# Altium schematic sheet CE842170260_SHEET6.SchDoc
size Tabloid; SheetNumber: 4; SheetTotal: 4; PageSetup: Record=PageOptions|CenterHorizontal=True|CenterVertical=True|PrintScale=0.70|XCorrection=1.00|YCorrection=1.00|PrintKind=1|BorderSize=5000000|LeftOffset=0|BottomOffset=0|Orientation=2|PaperLength=1000|PaperWidth=1000|Scale=100|PaperSource=7|PrintQuality=-4|MediaType=1|DitherType=10|PaperKind=8 1/2x11|PrintScaleMode=1; SPICEModelCacheMIYJXAQF: <root> / <DocumentId>MIYJXAQF</DocumentId> / </root>
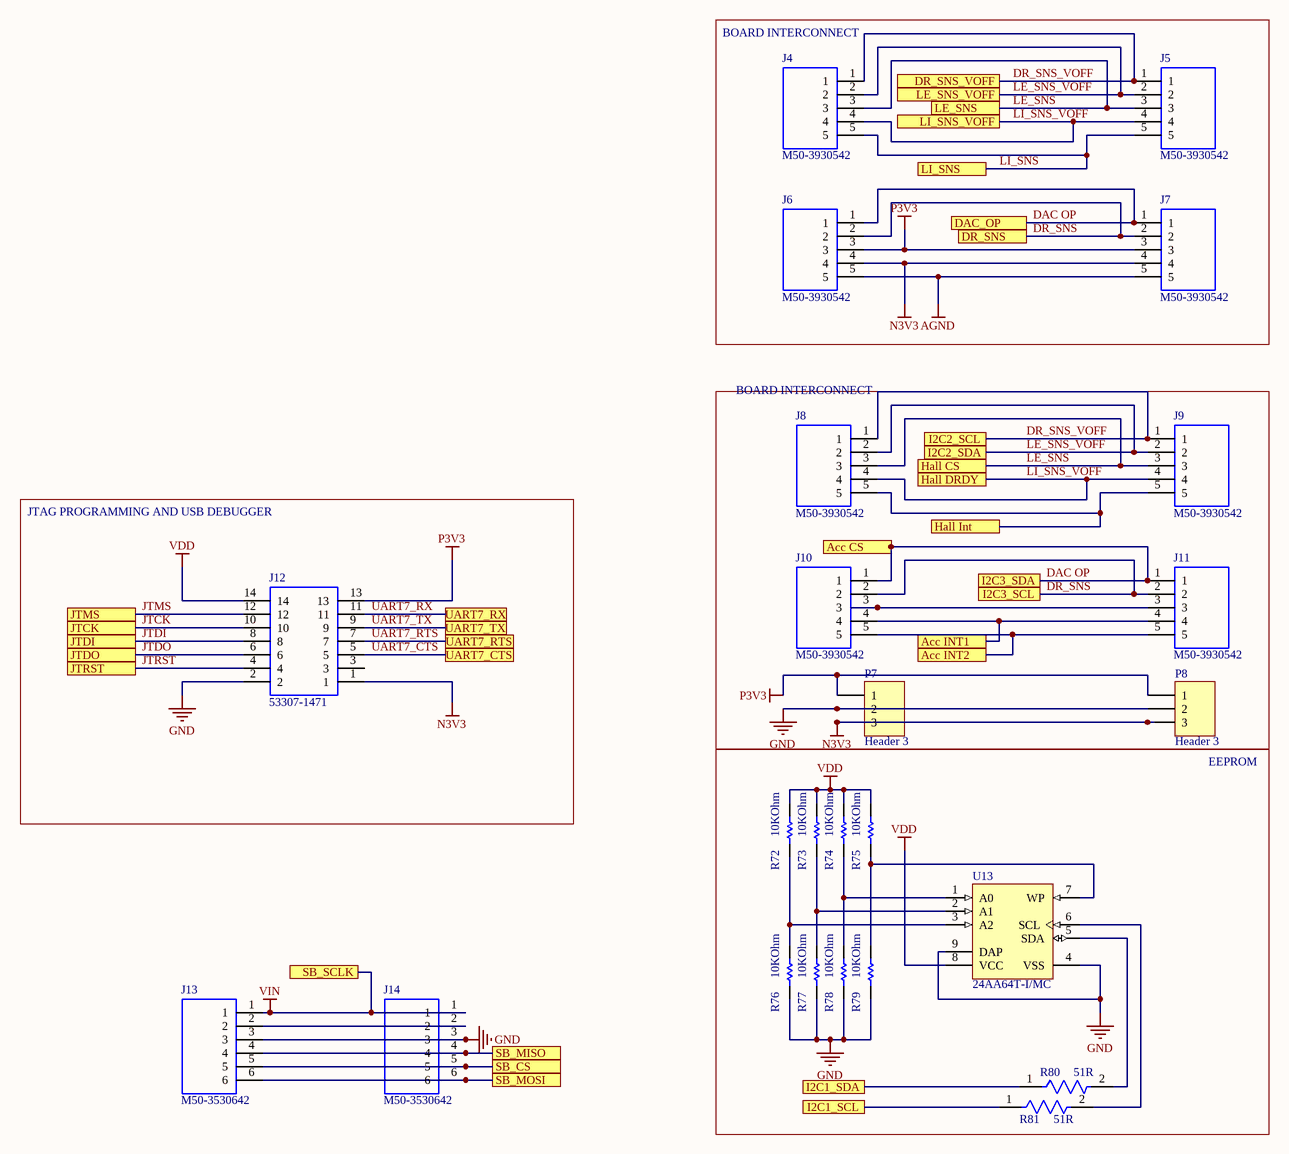
[diagram p0: CE842170260_SHEET6.SchDoc]

## Parts
J4  M50-3930542  [M50-3930542]
J5  M50-3930542  [M50-3930542]
J6  M50-3930542  [M50-3930542]
J7  M50-3930542  [M50-3930542]
J8  M50-3930542  [M50-3930542]
J9  M50-3930542  [M50-3930542]
J10  M50-3930542  [M50-3930542]
J11  M50-3930542  [M50-3930542]
J12  53307-1471  [533071471]
J13  M50-3530642  [HDRV6W30P0X127_1X6_762X210X430P]
J14  M50-3530642  [HDRV6W30P0X127_1X6_762X210X430P]
P7  Header 3  [HDR1X3]
P8  Header 3  [HDR1X3]
R72  Resistance: 10KOhm  [RESC1005X40X25LL05T05]  (hidden comment: ERJ2RKF1002X)
R73  Resistance: 10KOhm  [RESC1005X40X25LL05T05]  (hidden comment: ERJ2RKF1002X)
R74  Resistance: 10KOhm  [RESC1005X40X25LL05T05]  (hidden comment: ERJ2RKF1002X)
R75  Resistance: 10KOhm  [RESC1005X40X25LL05T05]  (hidden comment: ERJ2RKF1002X)
R76  Resistance: 10KOhm  [RESC1005X40X25LL05T05]  (hidden comment: ERJ2RKF1002X)
R77  Resistance: 10KOhm  [RESC1005X40X25LL05T05]  (hidden comment: ERJ2RKF1002X)
R78  Resistance: 10KOhm  [RESC1005X40X25LL05T05]  (hidden comment: ERJ2RKF1002X)
R79  Resistance: 10KOhm  [RESC1005X40X25LL05T05]  (hidden comment: ERJ2RKF1002X)
R80  Resistance: 51R  [FP-ERJ2RK-MFG]  (hidden comment: ERJ-2RKF51R0X)
R81  Resistance: 51R  [FP-ERJ2RK-MFG]  (hidden comment: ERJ-2RKF51R0X)
U13  24AA64T-I/MC  [DFN-MC8]

## Blocks framed on the sheet
BOARD INTERCONNECT: J4-J7
BOARD INTERCONNECT: J8-J11 P7 P8
JTAG PROGRAMMING AND USB DEBUGGER: J12
EEPROM: R72-R81 U13

## Ports
Acc CS, Acc INT1, Acc INT2, DAC_OP, DR_SNS, DR_SNS_VOFF, Hall CS, Hall DRDY, Hall Int, I2C1_SCL, I2C1_SDA, I2C2_SCL, I2C2_SDA, I2C3_SCL, I2C3_SDA, JTCK, JTDI, JTDO, JTMS, JTRST, LE_SNS, LE_SNS_VOFF, LI_SNS, LI_SNS_VOFF, SB_CS, SB_MISO, SB_MOSI, SB_SCLK, UART7_CTS, UART7_RTS, UART7_RX, UART7_TX

## Nets
AGND: J6.5 J7.5
GND: J12.2 J13.3 J14.3 P7.2 P8.2 R76.1 R77.1 R78.1 R79.1 U13.4(VSS) U13.9(DAP)
N3V3: J6.4 J7.4 J12.1 P7.3 P8.3
P3V3: J6.3 J7.3 J12.13 P7.1 P8.1
VDD: J12.14 R72.2 R73.2 R74.2 R75.2 U13.8(VCC)
VIN: J13.1 J14.1 ; port SB_SCLK
Acc INT1: J10.4 J11.4 ; port Acc INT1
Acc INT2: J10.5 J11.5 ; port Acc INT2
DAC OP: J6.1 J7.1 J10.1 J11.1 ; port DAC_OP, port Acc CS, port I2C3_SDA
DR_SNS: J6.2 J7.2 J10.2 J11.2 ; port DR_SNS, port I2C3_SCL
DR_SNS_VOFF: J4.1 J5.1 J8.1 J9.1 ; port DR_SNS_VOFF, port I2C2_SCL
Hall Int: J8.5 J9.5 ; port Hall Int
I2C1_SCL: R81.1 ; port I2C1_SCL
I2C1_SDA: R80.1 ; port I2C1_SDA
JTCK: J12.10 ; port JTCK
JTDI: J12.8 ; port JTDI
JTDO: J12.6 ; port JTDO
JTMS: J12.12 ; port JTMS
JTRST: J12.4 ; port JTRST
LE_SNS: J4.3 J5.3 J8.3 J9.3 ; port LE_SNS, port Hall CS
LE_SNS_VOFF: J4.2 J5.2 J8.2 J9.2 ; port LE_SNS_VOFF, port I2C2_SDA
LI_SNS: J4.5 J5.5 ; port LI_SNS
LI_SNS_VOFF: J4.4 J5.4 J8.4 J9.4 ; port LI_SNS_VOFF, port Hall DRDY
SB_CS: J13.5 J14.5 ; port SB_CS
SB_MISO: J13.4 J14.4 ; port SB_MISO
SB_MOSI: J13.6 J14.6 ; port SB_MOSI
UART7_CTS: J12.5 ; port UART7_CTS
UART7_RTS: J12.7 ; port UART7_RTS
UART7_RX: J12.11 ; port UART7_RX
UART7_TX: J12.9 ; port UART7_TX
NetJ10_3: J10.3 J11.3
NetJ13_2: J13.2 J14.2
NetR72_1: R72.1 R76.2 U13.3(A2)
NetR73_1: R73.1 R77.2 U13.2(A1)
NetR74_1: R74.1 R78.2 U13.1(A0)
NetR75_1: R75.1 R79.2 U13.7(WP)
NetR80_2: R80.2 U13.5(SDA)
NetR81_2: R81.2 U13.6(SCL)

Not connected (* = marked no-connect by the designer): J12 3

## Notes on the sheet
- BH CONFIDENTIAL
- NOTE
- Title:
- Sheet Title:
- Designed:
- Checked:
- Date:
- DRAWN IN ACCORDANCE WITH TECHNOLOGY WORK INSTRUCTIONS W064
- REV
- DATE
- ECR/ECN
- INT'L
- Number:
- Approved:
- FOR LIMITED NEED TO KNOW USE ONLY. NO PARTS OF THIS DOCUMENT MAY BE PRODUCED OR DISCLOSED WITHOUT PRIOR PERMISSION OF BH
- File:
- Sheet:
- of

## Library data of the parts
J4-J11 = M50-3930542: 1.27mm (0.05") Pitch SIL Horizontal Throughboard Pin Header, selective gold + tin, 5 contacts; Manufacturer_Name: Harwin; Geometry.Height: 2.3mm; Mouser Part Number: 855-M50-3930542; Mouser Price/Stock: https://www.mouser.co.uk/ProductDetail/Harwin/M50-3930542?qs=%252BdQmOuGyFcFb1vakt822Tg%3D%3D; Manufacturer_Part_Number: M50-3930542; Datasheet Link: https://cdn.harwin.com/pdfs/M50-393.pdf
J12 = 53307-1471: Board to Board & Mezzanine Connectors 0.8 BtB WaferAssy ST SMT 14Ckt EmbsTpPkg; Manufacturer_Name: Molex; Geometry.Height: 3.65mm; Mouser Part Number: 538-53307-1471; Mouser Price/Stock: https://www.mouser.co.uk/ProductDetail/Molex/53307-1471?qs=9BfFgGvh7CdNLBAt%252BUAvBg%3D%3D; Manufacturer_Part_Number: 53307-1471; Datasheet Link: https://www.molex.com/pdm_docs/sd/533071471_sd.pdf
J13 J14 = M50-3530642: Headers & Wire Housings 6 WAY SIL VERT PC TAIL P/HDR; Manufacturer_Name: Harwin; Geometry.Height: 4.3mm; Mouser Part Number: 855-M50-3530642; Mouser Price/Stock: https://www.mouser.co.uk/ProductDetail/Harwin/M50-3530642?qs=%252BdQmOuGyFcHPs2UJx%2F79Cg%3D%3D; Manufacturer_Part_Number: M50-3530642; Datasheet Link: https://cdn.harwin.com/pdfs/M50-353.pdf
P7 P8 = Header 3: Header, 3-Pin; LatestRevisionDate: 17-Jul-2002; LatestRevisionNote: Re-released for DXP Platform.; Publisher: Altium Limited
R72-R79 = CMP-2000-07588-1: Chip Resistor, 10 KOhm, +/- 1%, 0.1 W, -55 to 155 degC, 0402 (1005 Metric), RoHS, Tape and Reel; Manufacturer: Panasonic; Power Rating: 100mW; Voltage Rating: 50V; Case\/Package: 0402; Temperature Coefficient: 100ppm\/degreesC; RoHSCompliant: True; Lead Free: LeadFree; Package Quantity: 1; Contact Plating: Tin; Length: 1mm; Radiation Hardening: No; REACH SVHC: NoSVHC; Max Operating Temperature: 155degC; Depth: 0.5mm; Case Code (Imperial): 0402; Military Standard: Not; Package Description: 2-Pin Surface Mount Device, Body 1 x 0.5 mm; Termination: SMD/SMT; Case Code (Metric): 1005; Height: 0.35mm; Packaging: TapeandReel; Voltage Rating (DC): 50V; Package Reference: 402; Number of Pins: 2; Tolerance: 1%; Mounting Technology: SurfaceMount; Width: 0.02inch; Mount: SurfaceMount; Datasheet URL: https://industrial.panasonic.com/cdbs/www-data/pdf/RDA0000/AOA0000C304.pdf; Composition: ThickFilm; Datasheet Version: 02/2017; Manufacturer URL: http://www.panasonic.com/; Max Power Dissipation: 100mW; Number of Terminations: 2; Min Operating Temperature: -55degC
R80 R81 = CMP-2002-00977-2: RES SMD 51 OHM 1% 1/10W 0402; Power Rating: 100mW; Voltage Rating: 50V; Temperature Coefficient: 100ppm/°C; Case/Package: 0402; Lead Free: Lead Free; Case Code (Metric): 1005; Features: Automotive AEC-Q200; Max Operating Temperature: 155°C; Construction: Rectangular; Termination: SMD/SMT; Package Quantity: 1; Resistor Type: Thick Film; Resistance Tolerance: 1%; Tolerance: 1%; Mount: Surface Mount; Max Power Dissipation: 100mW; Technology: THICK FILM; Contact Plating: Tin; Width: 0.02inch; Case Code (Imperial): 0402; RoHS Compliant: Yes; Number of Terminations: 2; Packaging: Tape and Reel; Military Standard: Not; Length: 1mm; Depth: 0.5mm; Height: 0.35mm; Series: ERJ; Min Operating Temperature: -55°C; Voltage Rating (DC): 50V; REACH SVHC: No SVHC
U13 = CMP-0159-00447-1: 64Kbit, 400kHz, 1.7V, I2C Serial EEPROM, 8-Pin DFN, Industrial Temperature, Tape and Reel; DatasheetVersion: revQ, Jun-2009; PackageReference: DFN-MC8; PackageDescription: 8-Lead Plastic Dual Flat, No Lead Package (MC) - 2x3x0.9mm Body [DFN]; PackageVersion: revBB, Aug-2009